# EAGLE design Sled_8A_v1 (EAGLE 9.6.2)
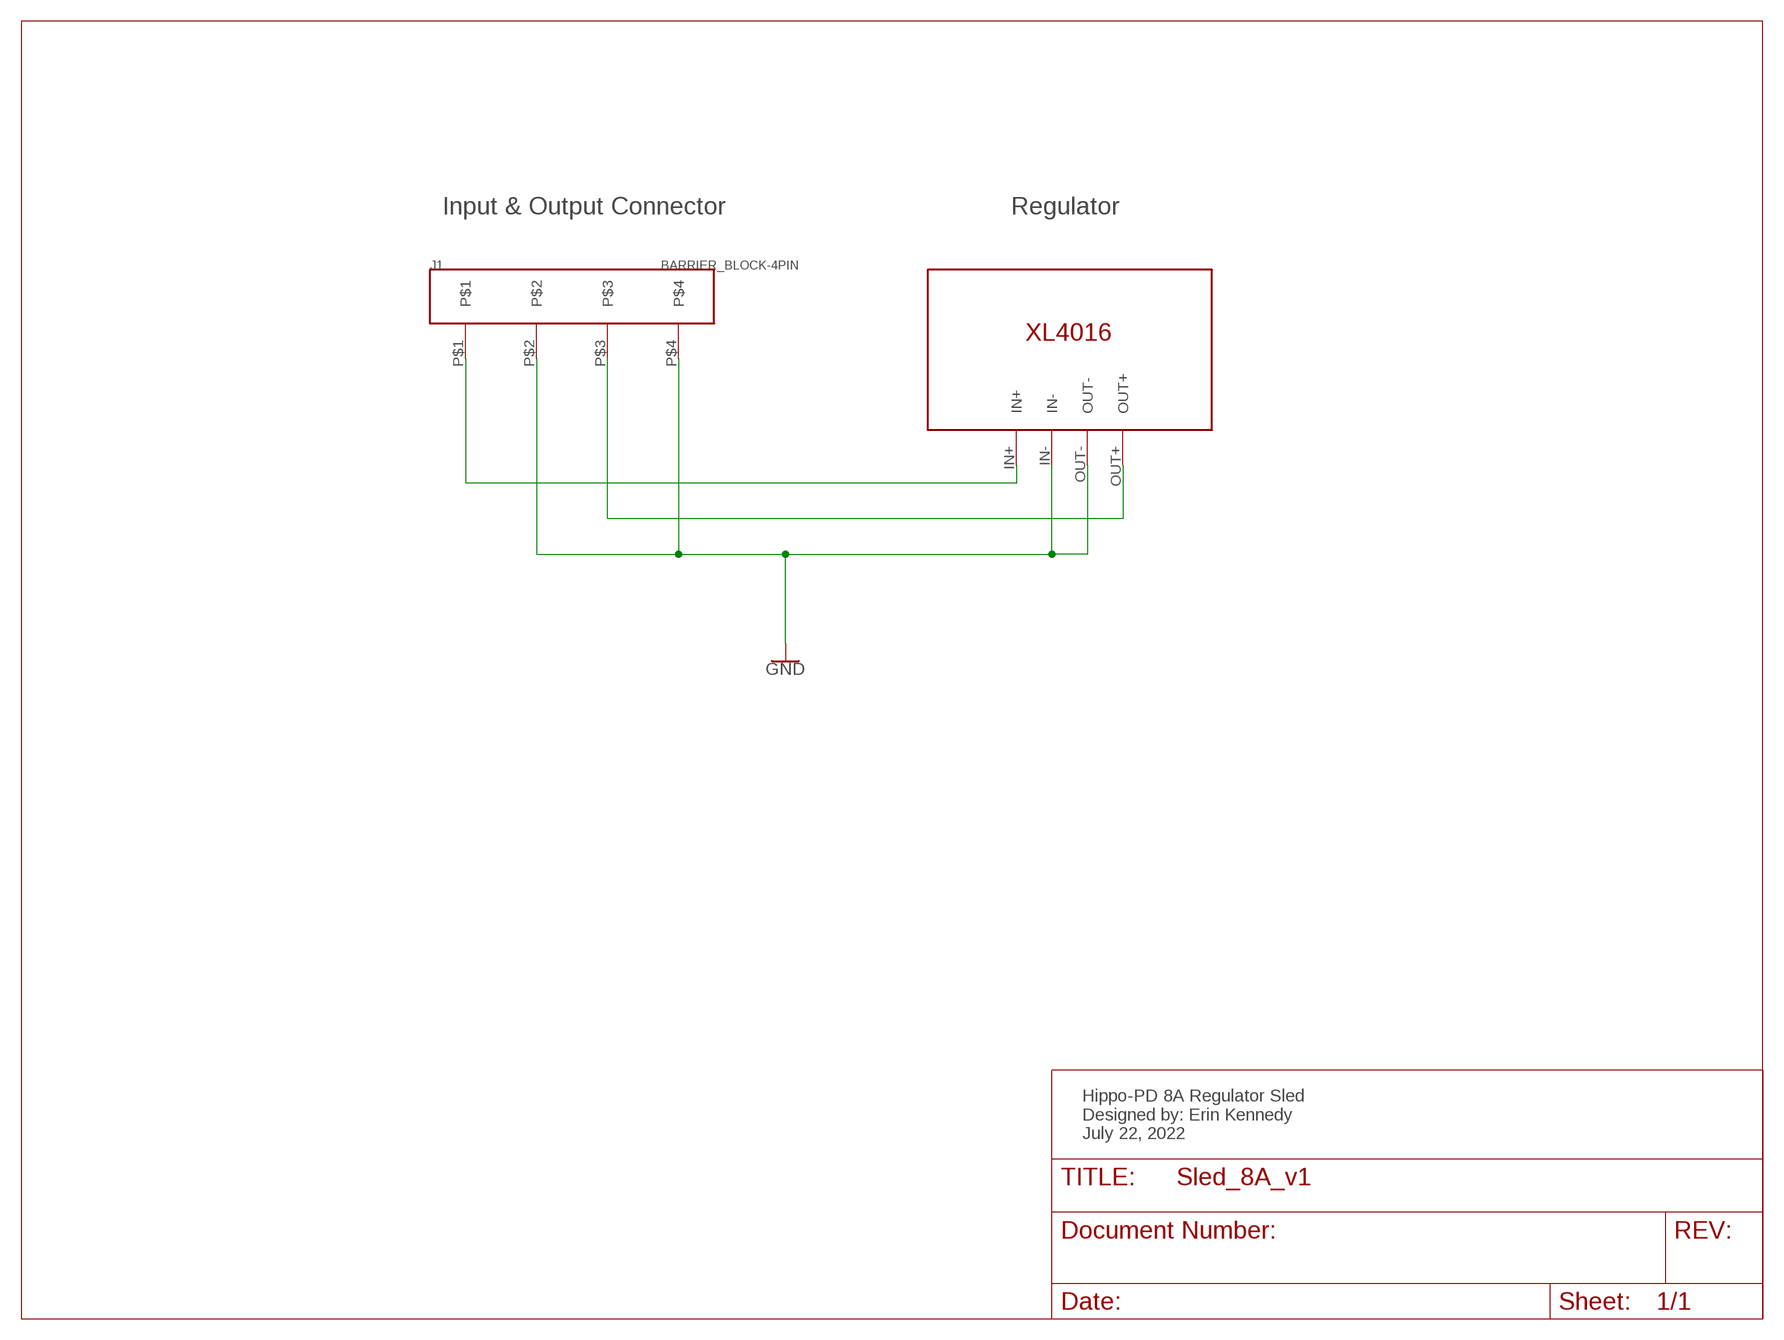
[diagram p0: schematic, sheet 1]

## Parts
J1  BARRIER_BLOCK-4PIN  [BARRIERBLOCK-4PIN]
U2  XL4016-DEV  [XL4016-DEV]

## Nets
GND: J1.P$2 J1.P$4 U2.IN- U2.OUT-
N$1: J1.P$1 U2.IN+
N$2: J1.P$3 U2.OUT+

## Notes on the sheet
- Input & Output Connector | Regulator
- Hippo-PD 8A Regulator Sled
  Designed by: Erin Kennedy
  July 22, 2022

## Library data of the parts
J1 = Hippo-PS:BARRIER_BLOCK-4PIN: Barrier block connector Digikey #ED2946-ND
U2 = Hippo-PS:XL4016-DEV

## Board
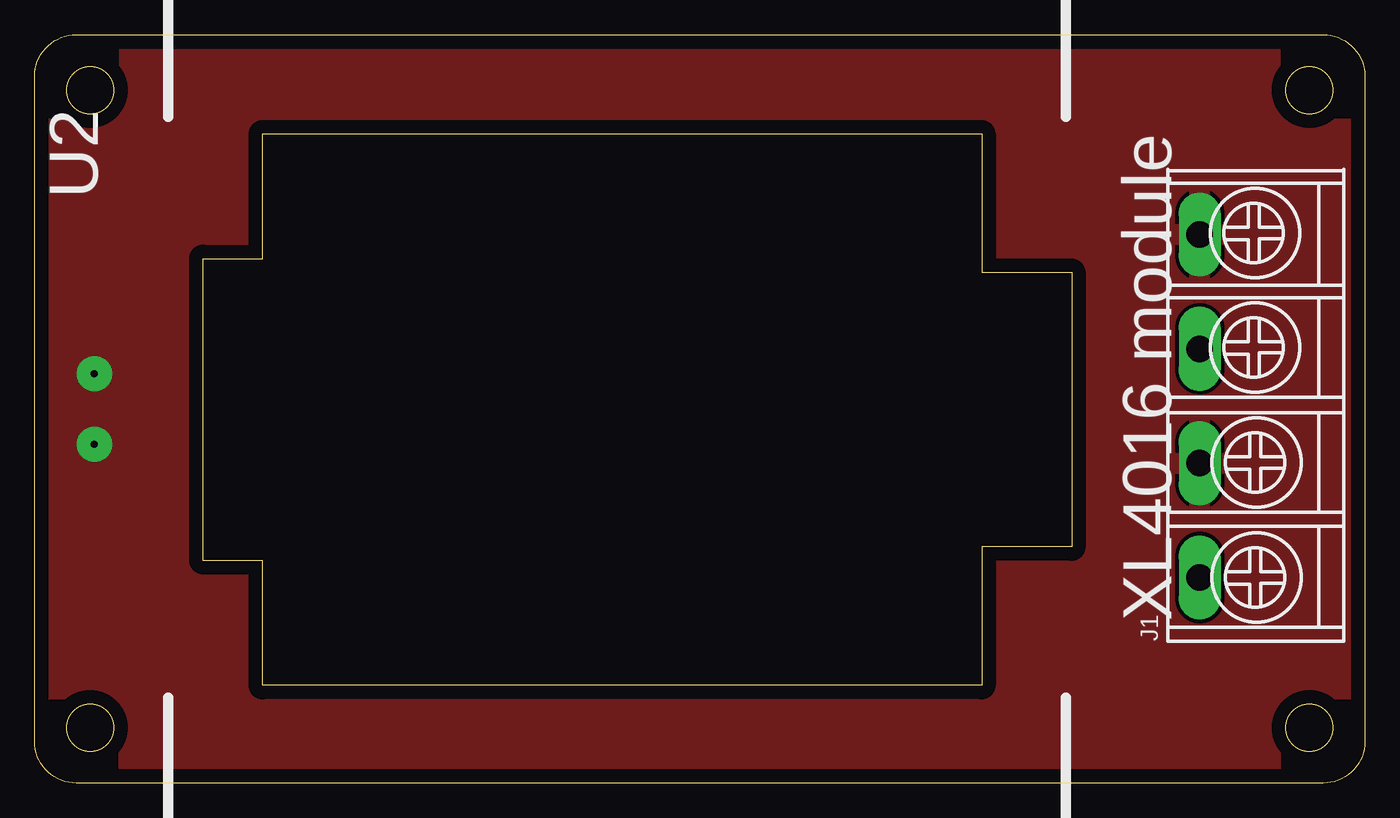
[diagram p1: board, top side]
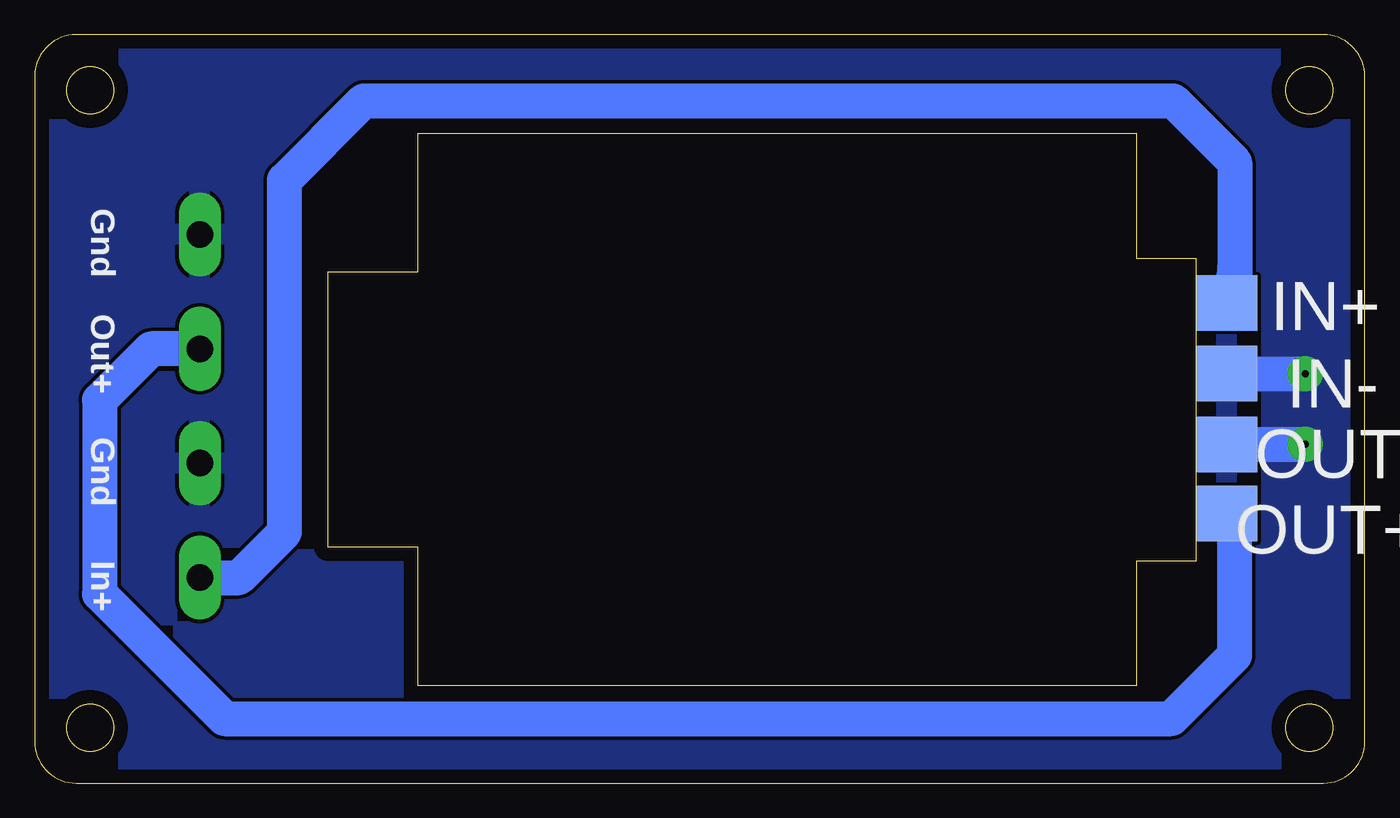
[diagram p2: board, bottom side, seen from below]

Size 96 x 54 mm. Coordinates in mm from the lower left corner, seen from the top.
Outline: 3,0 arc-90 0,3 0,51 arc-90 3,54 93,54 arc-90 96,51 96,3 arc-90 93,0 3,0
Outline: circle at 92,50 radius 1.7
Outline: circle at 4,4 radius 1.7
Outline: circle at 4,50 radius 1.7
Outline: circle at 92,4 radius 1.7
Copper layers (1*16): Top 0.035mm / dielectric 1.5mm / Bottom 0.035mm
Design rules "default *": minimum track width 8mil, minimum drill 0.35mm, track to track 10mil, track to pad 10mil, pad to pad 10mil, via to via 10mil, smd to smd 10mil, copper to edge 40mil, drill to drill 10mil, minimum pad ring 10mil, minimum via ring 8mil, stop-mask expansion 4mil, vias tented up to drill 0mil, thermal gap 10mil

### Footprints (pad centres in the part's own frame; a part is rotated, then mirrored left to right if it is on the bottom)
BARRIERBLOCK-4PIN = drill 1.905 pad 3.048 long: P$1 4.6,10.4; P$2 12.85,10.4; P$3 21.1,10.4; P$4 29.355,10.4
XL4016-DEV = smd 4 x 4.445 bottom: IN+ 10.9,0.334; IN- 16,0.334; OUT+ 26.1,0.334; OUT- 21.1,0.334

### Placement (x,y rotation side)
J1  94.48,10.24 90 top
U2  9.65,45.54 270 top

### Tracks (layer width: path | path; a pad name or v marks a point on that pad's centre or on a via)
GND  (via drill 0.51 pad 2.54)
  Bottom 2.54: U2.IN- v4.31,29.54 | U2.OUT- 4.33,24.44 v4.31,24.46
  pour Top: -7.12,62.56 102.1,62.56 102.1,-7.29 -10.93,-7.29 -10.93,62.56
  pour Bottom: -12.2,66.37 105.91,66.37 105.91,-9.83 -14.74,-9.83 -14.74,66.37
N$1
  Bottom 1.524: 9.39,37.16 9.98,36.57 U2.IN+
  Bottom 2.54: J1.P$1 81.25,14.84 77.97,18.11 77.97,43.51 72.26,49.23 13.84,49.23 9.39,44.78 9.39,37.16 9.39,35.23 9.86,34.76 9.86,34.64 | 9.86,34.64 9.41,34.64 9.39,34.62 9.86,34.15 | 9.86,34.15 9.86,33.98 | 9.86,34.15 9.86,34.64
N$2
  Bottom 1.524: 9.39,18.85 U2.OUT+
  Bottom 2.54: J1.P$3 87.61,31.34 91.31,27.63 91.31,13.66 82.29,4.65 13.96,4.65 9.39,9.22 9.39,18.85 9.86,19.32 9.86,19.44

### Text on the board
tNames: word
bNames: Gnd | Out+ | Gnd | In+